# EAGLE schematic EEZ DIB DCP405 r2B11 (EAGLE 7.2.0)
Assembly variants: Farnell, TME

## Sheet 1 of 6: Power pre-regulator
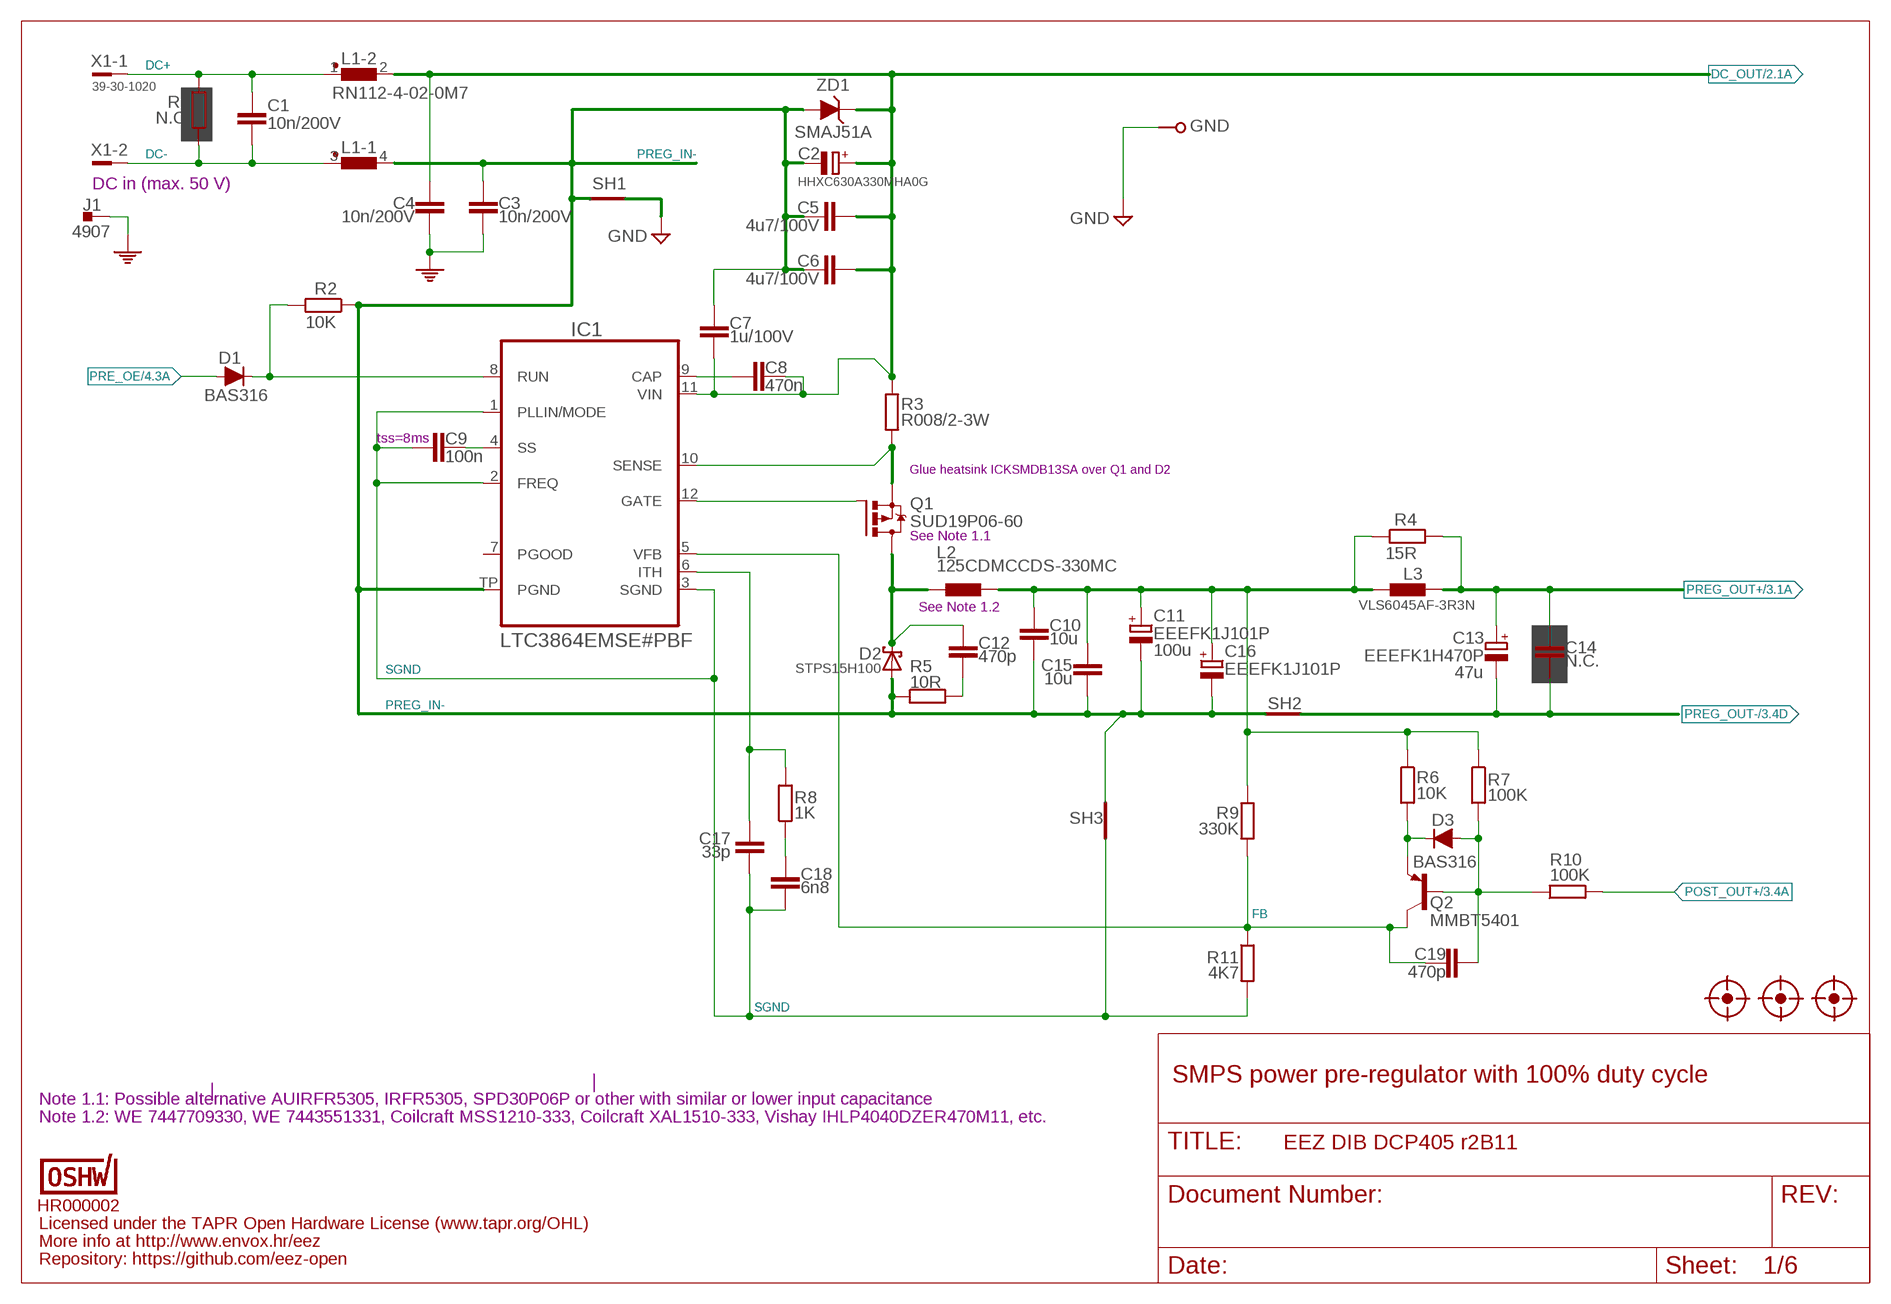
[diagram p0: schematic, sheet 1]

### Parts
C1  10n/200V  C-EUC1206  [C1206]
C2  HHXC630A330MHA0G  ECAPSMD8.3MM/HA0  [CAPAE830X1050N]
C3  10n/200V  C-EUC1206  [C1206]
C4  10n/200V  C-EUC1206  [C1206]
C5  4u7/100V  C-EUC1210  [C1210]
C6  4u7/100V  C-EUC1210  [C1210]
C7  1u/100V  C-EUC1206  [C1206]
C8  470n  C-EUC0805  [C0805]
C9  100n  C-EUC0603  [C0603]
C10  10u  C-EUC1210  [C1210]
C11  EEEFK1J101P  ECAP10X10  [CAPAE1030X1050N]
C12  470p  C-EUC0805  [C0805]
C13  EEEFK1H470P  ECAPSMD8.3MM/HA0  [CAPAE830X1050N]
C14  N.C.  C-EUC0805  [C0805]
C15  10u  C-EUC1210  [C1210]
C16  EEEFK1J101P  ECAP10X10  [CAPAE1030X1050N]
C17  33p  C-EUC0805  [C0805]
C18  6n8  C-EUC0805  [C0805]
C19  470p  C-EUC0805  [C0805]
D1  BAS316  DIODESOD323R  [SOD323-R]
D2  STPS15H100  SCHOTTKY-DUAL_A_L  [TO252-L]
D3  BAS316  DIODESOD323R  [SOD323-R]
FM1  FIDUCIAL_2  [FIDUCIAL_DUAL]
FM2  FIDUCIAL_2  [FIDUCIAL_DUAL]
FM3  FIDUCIAL_2  [FIDUCIAL_DUAL]
GND  PCB_TEST_TABSHIELD  [PCB_SHIELD_TAB]
IC1  LTC3864EMSE#PBF  LTC3864  [LTC_05-08-1666]
J1  4907  PCB_TAB-4907  [PCB_TAB-4907]
L1  RN112-4-02-0M7  RN112  [RN112]
L2  125CDMCCDS-330MC  125CDMCC/DS  [125CDMCC/DS]
L3  VLS6045AF-3R3N  COILCRAFT_HPI0630  [COILCRAFT_HPI0630]
OSHWA  HR000002  OSHWA-CERT-SMALL  [CERT-SMALL-SILK]
Q1  SUD19P06-60  P-MOSFETDPAK  [TO229P990X239-3N]
Q2  MMBT5401  BC857B-PNP-SOT23-BEC  [SOT23-BEC]
R1  N.C.  R-EU_R2512  [R2512]
R2  10K  R-EU_R0805  [R0805]
R3  R008/2-3W  R-EU_R2512  [R2512]
R4  15R  R-EU_R2010  [R2010]
R5  10R  R-EU_R1206  [R1206]
R6  10K  R-EU_R0805  [R0805]
R7  100K  R-EU_R0805  [R0805]
R8  1K  R-EU_R0805  [R0805]
R9  330K  R-EU_R0805  [R0805]
R10  100K  R-EU_R0805  [R0805]
R11  4K7  R-EU_R0805  [R0805]
SH1  SHORTNOHOLE  [SHORT_NOHOLE]
SH2  Pgnd to Pout- short  SHORTNOHOLE  [SHORT_NOHOLE]
SH3  Sgnd to Pgnd short  SHORTNOHOLE  [SHORT_NOHOLE]
X1  39-30-1020  MINIFIT_39301020  [MINIFIT_39301020]
ZD1  SMAJ51A  P6SMB68A  [DO214AA]

### Nets
DC+: C1.2 L1.1 R1.2 X1.1
DC-: C1.1 L1.3 R1.1 X1.2
DC_OUT: C2.+ C4.2 C5.1 C6.1 C7.1 C8.2 IC1.11(VIN) L1.2 R3.1 ZD1.C ; also sheet 2
FB: C19.1 IC1.5(VFB) Q2.C R9.2 R11.1
GND: GND.1 SH1.2(GND_B) ; also sheet 2,3,4,5,6
L_OUT: C10.1 C11.+ C15.1 C16.+ L2.2 L3.1 R4.1 R6.1 R7.1 R9.1
N$1: D3.C Q2.E R6.2
N$2: C18.1 R8.1
N$7: D1.C IC1.8(RUN) R2.2
N$8: C17.1 IC1.6(ITH) R8.2
N$23: C8.1 IC1.9(CAP)
N$27: C9.2 IC1.4(SS)
N$30: IC1.12(GATE) Q1.1(G)
N$38: C12.2 R5.2
N$79: C19.2 D3.A Q2.B R7.2 R10.1
PE: C3.2 C4.1 J1.1 J1.2 ; also sheet 6
POST_OUT+: R10.2 ; also sheet 3,6
PRE_OE: D1.A ; also sheet 4
PREG_IN-: C2.- C3.1 C5.2 C6.2 C7.2 C10.2 C11.- C15.2 C16.- D2.1(A) D2.2(A) IC1.TP(PGND) L1.4 R2.1 R5.1 SH1.1(GND_A) SH2.2(GND_B) SH3.2(GND_B) ZD1.A
PREG_OUT+: C13.+ C14.1 L3.2 R4.2 ; also sheet 3
PREG_OUT-: C13.- C14.2 SH2.1(GND_A) ; also sheet 3,5
SENSE: IC1.10(SENSE) Q1.3(S) R3.2
SGND: C9.1 C17.2 C18.2 IC1.1(PLLIN/MODE) IC1.2(FREQ) IC1.3(SGND) R11.2 SH3.1(GND_A)
SW: C12.1 D2.3(C) L2.1 Q1.2(D)
Unconnected: IC1.7(PGOOD)

### Notes on the sheet
- DC in (max. 50 V)
- tss=8ms
- Glue heatsink ICKSMDB13SA over Q1 and D2
- See Note 1.1
- See Note 1.2
- 100u
- 47u
- SMPS power pre-regulator with 100% duty cycle
- Note 1.1: Possible alternative AUIRFR5305, IRFR5305, SPD30P06P or other with similar or lower input capacitance
- Note 1.2: WE 7447709330, WE 7443551331, Coilcraft MSS1210-333, Coilcraft XAL1510-333, Vishay IHLP4040DZER470M11, etc.
- Licensed under the TAPR Open Hardware License (www.tapr.org/OHL)
- More info at http://www.envox.hr/eez
- Repository: https://github.com/eez-open

## Sheet 2 of 6: Bias power, DIB interface
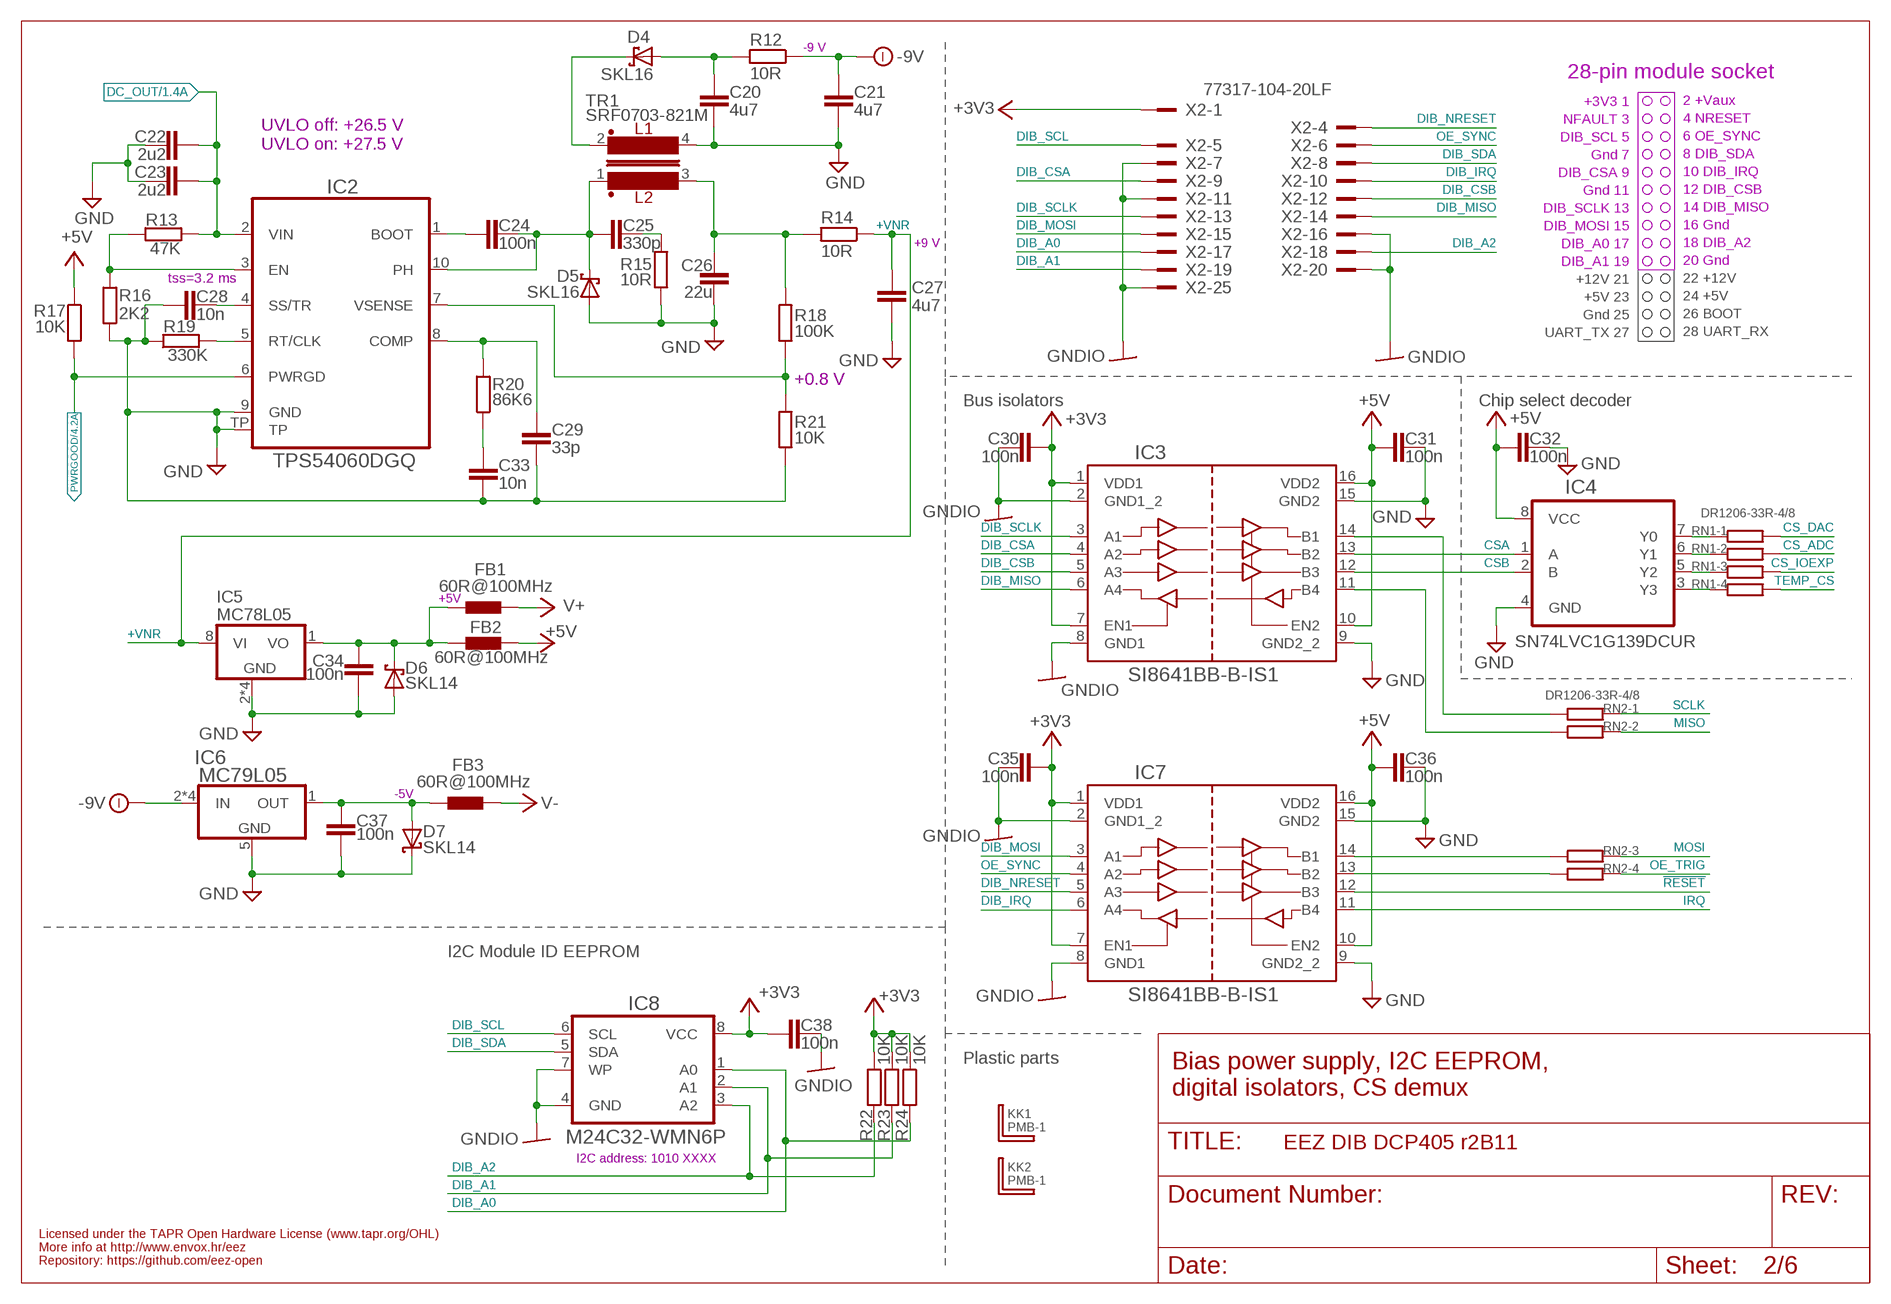
[diagram p1: schematic, sheet 2]

### Parts
C20  4u7  C-EUC1206  [C1206]
C21  4u7  C-EUC1206  [C1206]
C22  2u2  C-EUC1206  [C1206]
C23  2u2  C-EUC1206  [C1206]
C24  100n  C-EUC0603  [C0603]
C25  330p  C-EUC0805  [C0805]
C26  22u  C-EUC1210  [C1210]
C27  4u7  C-EUC1206  [C1206]
C28  10n  C-EUC0805  [C0805]
C29  33p  C-EUC0805  [C0805]
C30  100n  C-EUC0603  [C0603]
C31  100n  C-EUC0603  [C0603]
C32  100n  C-EUC0603  [C0603]
C33  10n  C-EUC0805  [C0805]
C34  100n  C-EUC0603  [C0603]
C35  100n  C-EUC0603  [C0603]
C36  100n  C-EUC0603  [C0603]
C37  100n  C-EUC0603  [C0603]
C38  100n  C-EUC0603  [C0603]
D4  SKL16  SCHOTTKYSOD123  [SOD123]
D5  SKL16  SCHOTTKYSOD123  [SOD123]
D6  SKL14  SCHOTTKYSOD123  [SOD123]
D7  SKL14  SCHOTTKYSOD123  [SOD123]
FB1  60R@100MHz  FERRITE_BEAD0603  [BEAD0603]
FB2  60R@100MHz  FERRITE_BEAD0603  [BEAD0603]
FB3  60R@100MHz  FERRITE_BEAD0603  [BEAD0603]
IC2  TPS54060DGQ  [SOP50P490X110-11N]
IC3  SI8641BB-B-IS1  SI8641NSOIC-16  [SOIC-16]
IC4  SN74LVC1G139DCUR  SN74LVC1G139-VSSOP  [DCU8]
IC5  MC78L05  MC78LXXSOIC8  [SOIC127P600X173-8N]
IC6  MC79L05  MC79LXXSOIC  [SOIC127P600X173-8N]
IC7  SI8641BB-B-IS1  SI8641NSOIC-16  [SOIC-16]
IC8  M24C32-WMN6P  AT24CXXSOIC8  [SOIC127P600X173-8N]
KK1  PMB-1  PCB-MB  [PCB-MB]
KK2  PMB-1  PCB-MB  [PCB-MB]
R12  10R  R-EU_R1206  [R1206]
R13  47K  R-EU_R0805  [R0805]
R14  10R  R-EU_R1206  [R1206]
R15  10R  R-EU_R1206  [R1206]
R16  2K2  R-EU_R0805  [R0805]
R17  10K  R-EU_R0805  [R0805]
R18  100K  R-EU_R0805  [R0805]
R19  330K  R-EU_R0805  [R0805]
R20  86K6  R-EU_R0805  [R0805]
R21  10K  R-EU_R0805  [R0805]
R22  10K  R-EU_R0805  [R0805]
R23  10K  R-EU_R0805  [R0805]
R24  10K  R-EU_R0805  [R0805]
RN1  DR1206-33R-4/8  R_ARRAY4  [CAY16]
RN2  DR1206-33R-4/8  R_ARRAY4  [CAY16]
TR1  SRF0703-821M  BOURNS_SRF0703INV  [SRF0703]
X2  77317-104-20LF  77317-104-28LF  [77317-104-28LF]

### Nets
!RESET: IC7.12(B3) ; also sheet 4
+3V3: C30.1 C35.1 C38.2 IC3.1(VDD1) IC3.7(EN1) IC7.1(VDD1) IC7.7(EN1) IC8.8(VCC) R22.1 R23.1 R24.1 X2.1
+5V: C31.2 C32.1 C36.2 FB2.P$2 IC3.10(EN2) IC3.16(VDD2) IC4.8(VCC) IC7.10(EN2) IC7.16(VDD2) R17.1 ; also sheet 4,5,6
+5VOUT: C34.1 D6.C FB1.P$1 FB2.P$1 IC5.1(VO)
+VNR: C27.1 IC5.8(VI) R14.1
-9V: C21.1 IC6.2(IN) IC6.3(IN) IC6.6(IN) IC6.7(IN) R12.1 ; also sheet 3
CS_ADC: RN1.7 ; also sheet 4
CS_DAC: RN1.8 ; also sheet 4
CS_IOEXP: RN1.6 ; also sheet 4
CSA: IC3.13(B2) IC4.1(A)
CSB: IC3.12(B3) IC4.2(B)
DC_OUT: C22.1 C23.1 IC2.2(VIN) R13.2 ; also sheet 1
DIB_A0: IC8.1(A0) R24.2 X2.17
DIB_A1: IC8.2(A1) R23.2 X2.19
DIB_A2: IC8.3(A2) R22.2 X2.18
DIB_CSA: IC3.4(A2) X2.9
DIB_CSB: IC3.5(A3) X2.12
DIB_IRQ: IC7.6(A4) X2.10
DIB_MISO: IC3.6(A4) X2.14
DIB_MOSI: IC7.3(A1) X2.15
DIB_NRESET: IC7.5(A3) X2.4
DIB_SCL: IC8.6(SCL) X2.5
DIB_SCLK: IC3.3(A1) X2.13
DIB_SDA: IC8.5(SDA) X2.8
GND: C20.2 C21.2 C22.2 C23.2 C26.2 C27.2 C28.2 C29.1 C31.1 C32.2 C33.1 C34.2 C36.1 C37.1 D5.A D6.A D7.C IC2.9(GND) IC2.TP IC3.9(GND2_2) IC3.15(GND2) IC4.4(GND) IC5.2(GND) IC5.3(GND) IC5.6(GND) IC5.7(GND) IC6.5(GND) IC7.9(GND2_2) IC7.15(GND2) R15.1 R16.1 R19.1 R21.1 TR1.4 ; also sheet 1,3,4,5,6
GNDIO: C30.2 C35.2 C38.1 IC3.2(GND1_2) IC3.8(GND1) IC7.2(GND1_2) IC7.8(GND1) IC8.4(GND) IC8.7(WP) X2.7 X2.11 X2.16 X2.20 X2.25
IRQ: IC7.11(B4) ; also sheet 4
MISO: RN2.7 ; also sheet 4
MOSI: RN2.6 ; also sheet 4
N$3: IC7.13(B2) RN2.4
N$4: IC4.5(Y2) RN1.3
N$6: IC4.7(Y0) RN1.1
N$9: IC3.11(B4) RN2.2
N$22: IC4.6(Y1) RN1.2
N$26: C25.2 R15.2
N$29: C37.2 D7.A FB3.P$1 IC6.1(OUT)
N$34: IC2.3(EN) R13.1 R16.2
N$41: C28.1 IC2.4(SS/TR)
N$48: IC2.5(RT/CLK) R19.2
N$50: C29.2 IC2.8(COMP) R20.2
N$51: C33.2 R20.1
N$52: IC4.3(Y3) RN1.4
N$60: C24.2 IC2.1(BOOT)
N$61: IC7.14(B1) RN2.3
N$62: IC2.7(VSENSE) R18.1 R21.2
N$122: IC3.14(B1) RN2.1
N$179: C20.1 D4.A R12.2
OE_SYNC: IC7.4(A2) X2.6
OE_TRIG: RN2.5 ; also sheet 4
PH: C24.1 C25.1 D5.C IC2.10(PH) TR1.1
PWRGOOD: IC2.6(PWRGD) R17.2 ; also sheet 4
SCLK: RN2.8 ; also sheet 4
TEMP_CS: RN1.5 ; also sheet 4
V+: FB1.P$2 ; also sheet 3,4,5
V-: FB3.P$2 ; also sheet 3,5
VOUT+: C26.1 R14.2 R18.2 TR1.3
VOUT-: D4.C TR1.2
Unconnected: X2.2 X2.3 X2.21 X2.22 X2.23 X2.24 X2.26 X2.27 X2.28

### Notes on the sheet
- -9 V
- 28-pin module socket
- +3V3 1
- 2 +Vaux
- NFAULT 3
- 4 NRESET
- DIB_SCL 5
- 6 OE_SYNC
- UVLO off: +26.5 V
  UVLO on: +27.5 V
- Gnd 7
- 8 DIB_SDA
- DIB_CSA 9
- 10 DIB_IRQ
- Gnd 11
- 12 DIB_CSB
- DIB_SCLK 13
- 14 DIB_MISO
- DIB_MOSI 15
- 16 Gnd
- +9 V | DIB_A0 17
- 18 DIB_A2
- DIB_A1 19
- 20 Gnd
- +12V 21
- tss=3.2 ms | 22 +12V
- +5V 23
- 24 +5V
- Gnd 25
- 26 BOOT
- UART_TX 27
- 28 UART_RX
- +0.8 V
- Bus isolators | Chip select decoder
- +5V
- -5V
- I2C Module ID EEPROM
- Plastic parts
- Bias power supply, I2C EEPROM,
  digital isolators, CS demux
- I2C address: 1010 XXXX
- Licensed under the TAPR Open Hardware License (www.tapr.org/OHL)
- More info at http://www.envox.hr/eez
- Repository: https://github.com/eez-open

## Sheet 3 of 6: Post-regulator
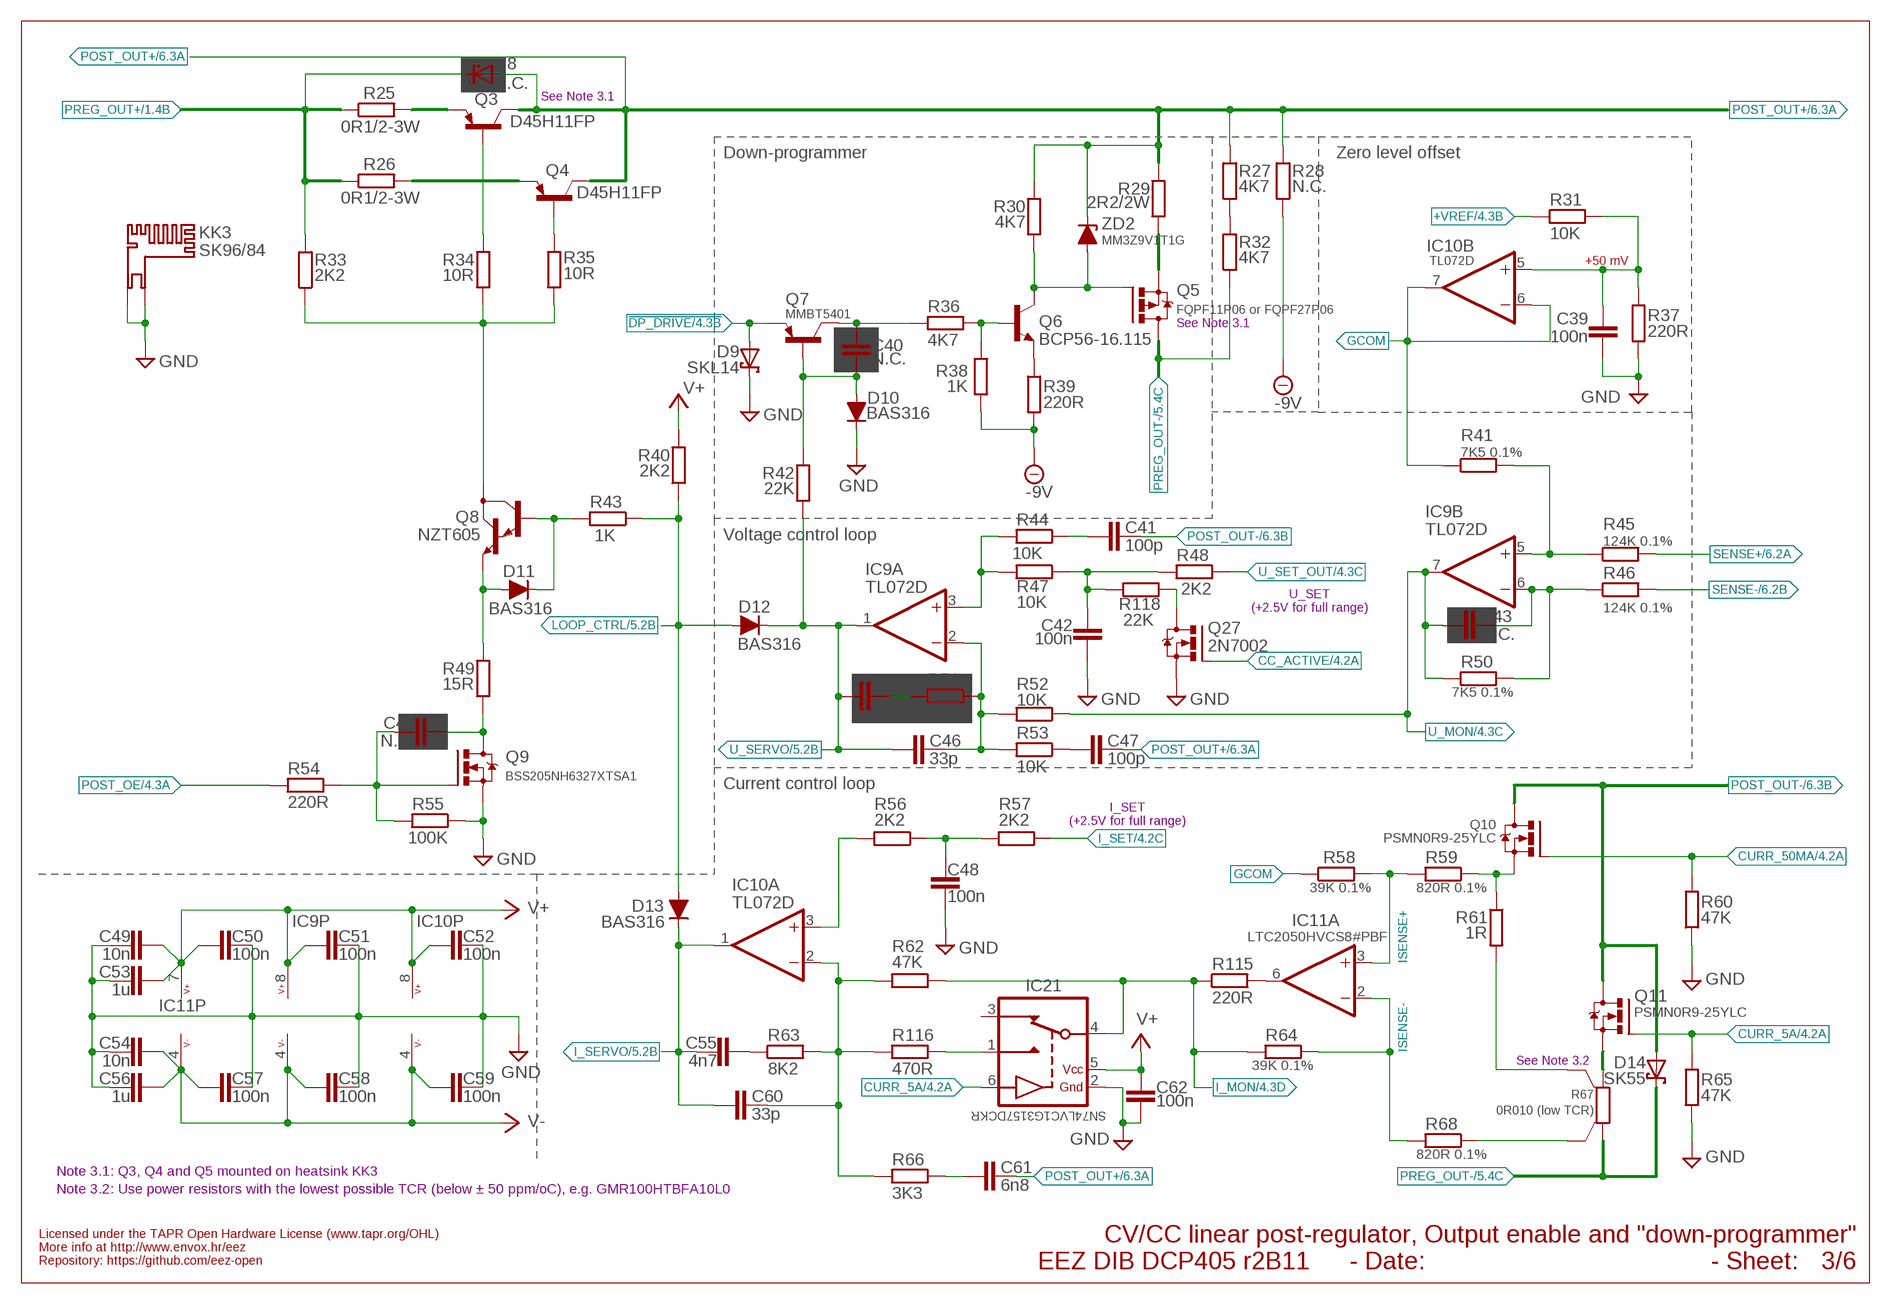
[diagram p2: schematic, sheet 3]

### Parts
C39  100n  C-EUC0603  [C0603]
C40  N.C.  C-EUC0805  [C0805]
C41  100p  C-EUC0805  [C0805]
C42  100n  C-EUC0603  [C0603]
C43  N.C.  C-EUC0805  [C0805]
C44  N.C.  C-EUC0805  [C0805]
C45  N.C.  C-EUC0805  [C0805]
C46  33p  C-EUC0805  [C0805]
C47  100p  C-EUC0805  [C0805]
C48  100n  C-EUC0603  [C0603]
C49  10n  C-EUC0805  [C0805]
C50  100n  C-EUC0603  [C0603]
C51  100n  C-EUC0603  [C0603]
C52  100n  C-EUC0603  [C0603]
C53  1u  C-EUC0805  [C0805]
C54  10n  C-EUC0805  [C0805]
C55  4n7  C-EUC0805  [C0805]
C56  1u  C-EUC0805  [C0805]
C57  100n  C-EUC0603  [C0603]
C58  100n  C-EUC0603  [C0603]
C59  100n  C-EUC0603  [C0603]
C60  33p  C-EUC0805  [C0805]
C61  6n8  C-EUC0805  [C0805]
C62  100n  C-EUC0603  [C0603]
D8  N.C.  SCHOTTKYSOD123  [SOD123]
D9  SKL14  SCHOTTKYSOD123  [SOD123]
D10  BAS316  DIODESOD323R  [SOD323-R]
D11  BAS316  DIODESOD323R  [SOD323-R]
D12  BAS316  DIODESOD323R  [SOD323-R]
D13  BAS316  DIODESOD323R  [SOD323-R]
D14  SK55  SCHOTTKYSMB  [SMB]
IC9  TL072D  TL072SOIC8  [SOIC127P600X173-8N]
IC10  TL072D  TL072SOIC8  [SOIC127P600X173-8N]
IC11  LTC2050HVCS8#PBF  OP27GSZSO8  [SOIC127P600X173-8N]
IC21  SN74LVC1G3157DCKR  SN74LVC1G3157-DCK  [SOT65P210X110-6N]
KK3  SK96/84  [SK96/84]
Q3  D45H11FP  D45H11-FPV  [TO220FP-V]
Q4  D45H11FP  D45H11-FPV  [TO220FP-V]
Q5  FQPF11P06 or FQPF27P06  P-MOSFET-FPV  [TO220FP-V]
Q6  BCP56-16.115  BCP56  [SOT230P700X180-4N]
Q7  MMBT5401  BC857B-PNP-SOT23-BEC  [SOT23-BEC]
Q8  NZT605  [SOT230P700X180-4N]
Q9  BSS205NH6327XTSA1  2N7002  [SOT103P240X110-3N]
Q10  PSMN0R9-25YLC  N-MOSFETLFPAK  [SOT669]
Q11  PSMN0R9-25YLC  N-MOSFETLFPAK  [SOT669]
Q27  2N7002  [SOT103P240X110-3N]
R25  0R1/2-3W  R-EU_R2512  [R2512]
R26  0R1/2-3W  R-EU_R2512  [R2512]
R27  4K7  R-EU_R0805  [R0805]
R28  N.C.  R-EU_R0805  [R0805]
R29  2R2/2W  R-EU_R2512  [R2512]
R30  4K7  R-EU_R0805  [R0805]
R31  10K  R-EU_R0805  [R0805]
R32  4K7  R-EU_R0805  [R0805]
R33  2K2  R-EU_R0805  [R0805]
R34  10R  R-EU_R1206  [R1206]
R35  10R  R-EU_R1206  [R1206]
R36  4K7  R-EU_R0805  [R0805]
R37  220R  R-EU_R0805  [R0805]
R38  1K  R-EU_R0805  [R0805]
R39  220R  R-EU_R0805  [R0805]
R40  2K2  R-EU_R0805  [R0805]
R41  7K5 0.1%  R-EU_R0805  [R0805]
R42  22K  R-EU_R0805  [R0805]
R43  1K  R-EU_R0805  [R0805]
R44  10K  R-EU_R0805  [R0805]
R45  124K 0.1%  R-EU_R0805  [R0805]
R46  124K 0.1%  R-EU_R0805  [R0805]
R47  10K  R-EU_R0805  [R0805]
R48  2K2  R-EU_R0805  [R0805]
R49  15R  R-EU_R2010  [R2010]
R50  7K5 0.1%  R-EU_R0805  [R0805]
R51  N.C.  R-EU_R0805  [R0805]
R52  10K  R-EU_R0805  [R0805]
R53  10K  R-EU_R0805  [R0805]
R54  220R  R-EU_R0805  [R0805]
R55  100K  R-EU_R0805  [R0805]
R56  2K2  R-EU_R0805  [R0805]
R57  2K2  R-EU_R0805  [R0805]
R58  39K 0.1%  R-EU_R0805  [R0805]
R59  820R 0.1%  R-EU_R0805  [R0805]
R60  47K  R-EU_R0805  [R0805]
R61  1R  R-EU_R1206  [R1206]
R62  47K  R-EU_R0805  [R0805]
R63  8K2  R-EU_R0805  [R0805]
R64  39K 0.1%  R-EU_R0805  [R0805]
R65  47K  R-EU_R0805  [R0805]
R66  3K3  R-EU_R0805  [R0805]
R67  0R010 (low TCR)  R-EU_4WIRE2512  [R_2512-4WIRE]
R68  820R 0.1%  R-EU_R0805  [R0805]
R115  220R  R-EU_R0805  [R0805]
R116  470R  R-EU_R0805  [R0805]
R118  22K  R-EU_R0805  [R0805]
ZD2  MM3Z9V1T1G  ZENER-DIODESOD323R  [SOD323-R]

### Nets
5A_S: Q11.1(S) Q11.2(S) Q11.3(S) R67.2
50MA_S: Q10.1(S) Q10.2(S) Q10.3(S) R59.1 R61.1
!DP_DRIVE: D9.A Q7.E ; also sheet 4
+VREF: R31.1 ; also sheet 4
-9V: R28.1 R38.2 R39.2 ; also sheet 2
CC_ACTIVE: Q27.1(G) ; also sheet 4,5
CURR_5A: IC21.6(CTRL) Q11.4(G) R65.2 ; also sheet 4
CURR_50MA: Q10.4(G) R60.2 ; also sheet 4
DARL_C: Q8.2(C) Q8.4(C) R33.1 R34.1 R35.1
DP_S: Q5.3(S) R29.1
GCOM: IC10.6(B:-IN) IC10.7(B:OUT) R41.1 R58.1
GND: C39.2 C42.2 C48.2 C49.1 C50.2 C51.1 C52.1 C53.1 C54.1 C56.1 C57.2 C58.1 C59.1 C62.2 D9.C D10.C IC21.2(GND) KK3.1 KK3.2 Q9.2(S) Q27.2(S) R37.2 R55.1 R60.1 R65.1 ; also sheet 1,2,4,5,6
I_MON: IC21.4(COM) R62.1 R64.2 R115.1 ; also sheet 4
I_SERVO: C55.2 C60.2 D13.C IC10.1(A:OUT) ; also sheet 5
I_SET: R57.1 ; also sheet 4
ISENSE+: IC11.3(A:+IN) R58.2 R59.2
ISENSE-: IC11.2(A:-IN) R64.1 R68.2
LOOP_CTRL: D12.A D13.A R40.1 R43.1 ; also sheet 5
N$10: C48.1 R56.1 R57.2
N$11: R61.2 R67.2S
N$14: C44.1 R51.2
N$35: C45.2 Q9.3(D) R49.1
N$37: C55.1 R63.1
N$39: Q6.1(B) R36.1 R38.1
N$40: Q4.1(B) R35.2
N$43: Q3.1(B) R34.2
N$45: C40.2 Q7.C R36.2
N$46: D11.C Q8.1(B) R43.2
N$47: D11.A Q8.3(E) R49.2
N$49: R27.1 R32.2
N$53: C45.1 Q9.1(G) R54.1 R55.2
N$54: IC11.6(A:OUT) R115.2
N$55: C40.1 D10.A Q7.B R42.2
N$57: IC21.1(NO) R116.1
N$58: Q27.3(D) R118.1
N$82: IC10.3(A:+IN) R56.2
N$83: IC9.3(A:+IN) R44.2 R47.2
N$84: C46.1 IC9.2(A:-IN) R51.1 R52.2 R53.2
N$88: C61.2 R66.1
N$89: C60.1 IC10.2(A:-IN) R62.2 R63.2 R66.2 R116.2
N$90: C41.2 R44.1
N$91: C47.2 R53.1
N$98: Q6.3(E) R39.1
N$102: C39.1 IC10.5(B:+IN) R31.2 R37.1
N$150: IC9.5(B:+IN) R41.2 R45.1
N$158: C43.1 IC9.6(B:-IN) R46.1 R50.2
N$200: R67.1S R68.1
PASS_E1: Q3.3(E) R25.2
PASS_E2: Q4.3(E) R26.2
POST_OE: R54.2 ; also sheet 4
POST_OUT+: C47.1 C61.1 D8.A Q3.2(C) Q4.2(C) R27.2 R28.2 R29.2 R30.1 ZD2.C ; also sheet 1,6
POST_OUT-: C41.1 D14.A Q10.MB(D) Q11.MB(D) ; also sheet 6
PREG_OUT+: D8.C R25.1 R26.1 R33.2 ; also sheet 1
PREG_OUT-: D14.C Q5.2(D) R32.1 R67.1 ; also sheet 1,5
Q6C: Q5.1(G) Q6.2(C) Q6.4(C) R30.2 ZD2.A
SENSE+: R45.2 ; also sheet 6
SENSE-: R46.2 ; also sheet 6
U_MON: C43.2 IC9.7(B:OUT) R50.1 R52.1 ; also sheet 4,5
U_SERVO: C44.2 C46.2 D12.C IC9.1(A:OUT) R42.1 ; also sheet 5
U_SET_OUT: R48.1 ; also sheet 4,5
U_SET_OVP: C42.1 R47.1 R48.2 R118.2
V+: C49.2 C50.1 C51.2 C52.2 C53.2 C62.1 IC9.8(P:V+) IC10.8(P:V+) IC11.7(P:V+) IC21.5(VDD) R40.2 ; also sheet 2,4,5
V-: C54.2 C56.2 C57.1 C58.2 C59.2 IC9.4(P:V-) IC10.4(P:V-) IC11.4(P:V-) ; also sheet 2,5
Unconnected: IC21.3(NC)

### Notes on the sheet
- See Note 3.1
- Down-programmer | Zero level offset
- +50 mV
- See Note 3.1
- Voltage control loop
- U_SET
  (+2.5V for full range)
- Current control loop
- I_SET
  (+2.5V for full range)
- See Note 3.2
- Note 3.1: Q3, Q4 and Q5 mounted on heatsink KK3
- Note 3.2: Use power resistors with the lowest possible TCR (below ± 50 ppm/oC), e.g. GMR100HTBFA10L0
- Licensed under the TAPR Open Hardware License (www.tapr.org/OHL)
- CV/CC linear post-regulator, Output enable and "down-programmer"
- More info at http://www.envox.hr/eez
- Repository: https://github.com/eez-open
- - Date: | - Sheet:

## Sheet 4 of 6: Digital control, Vref
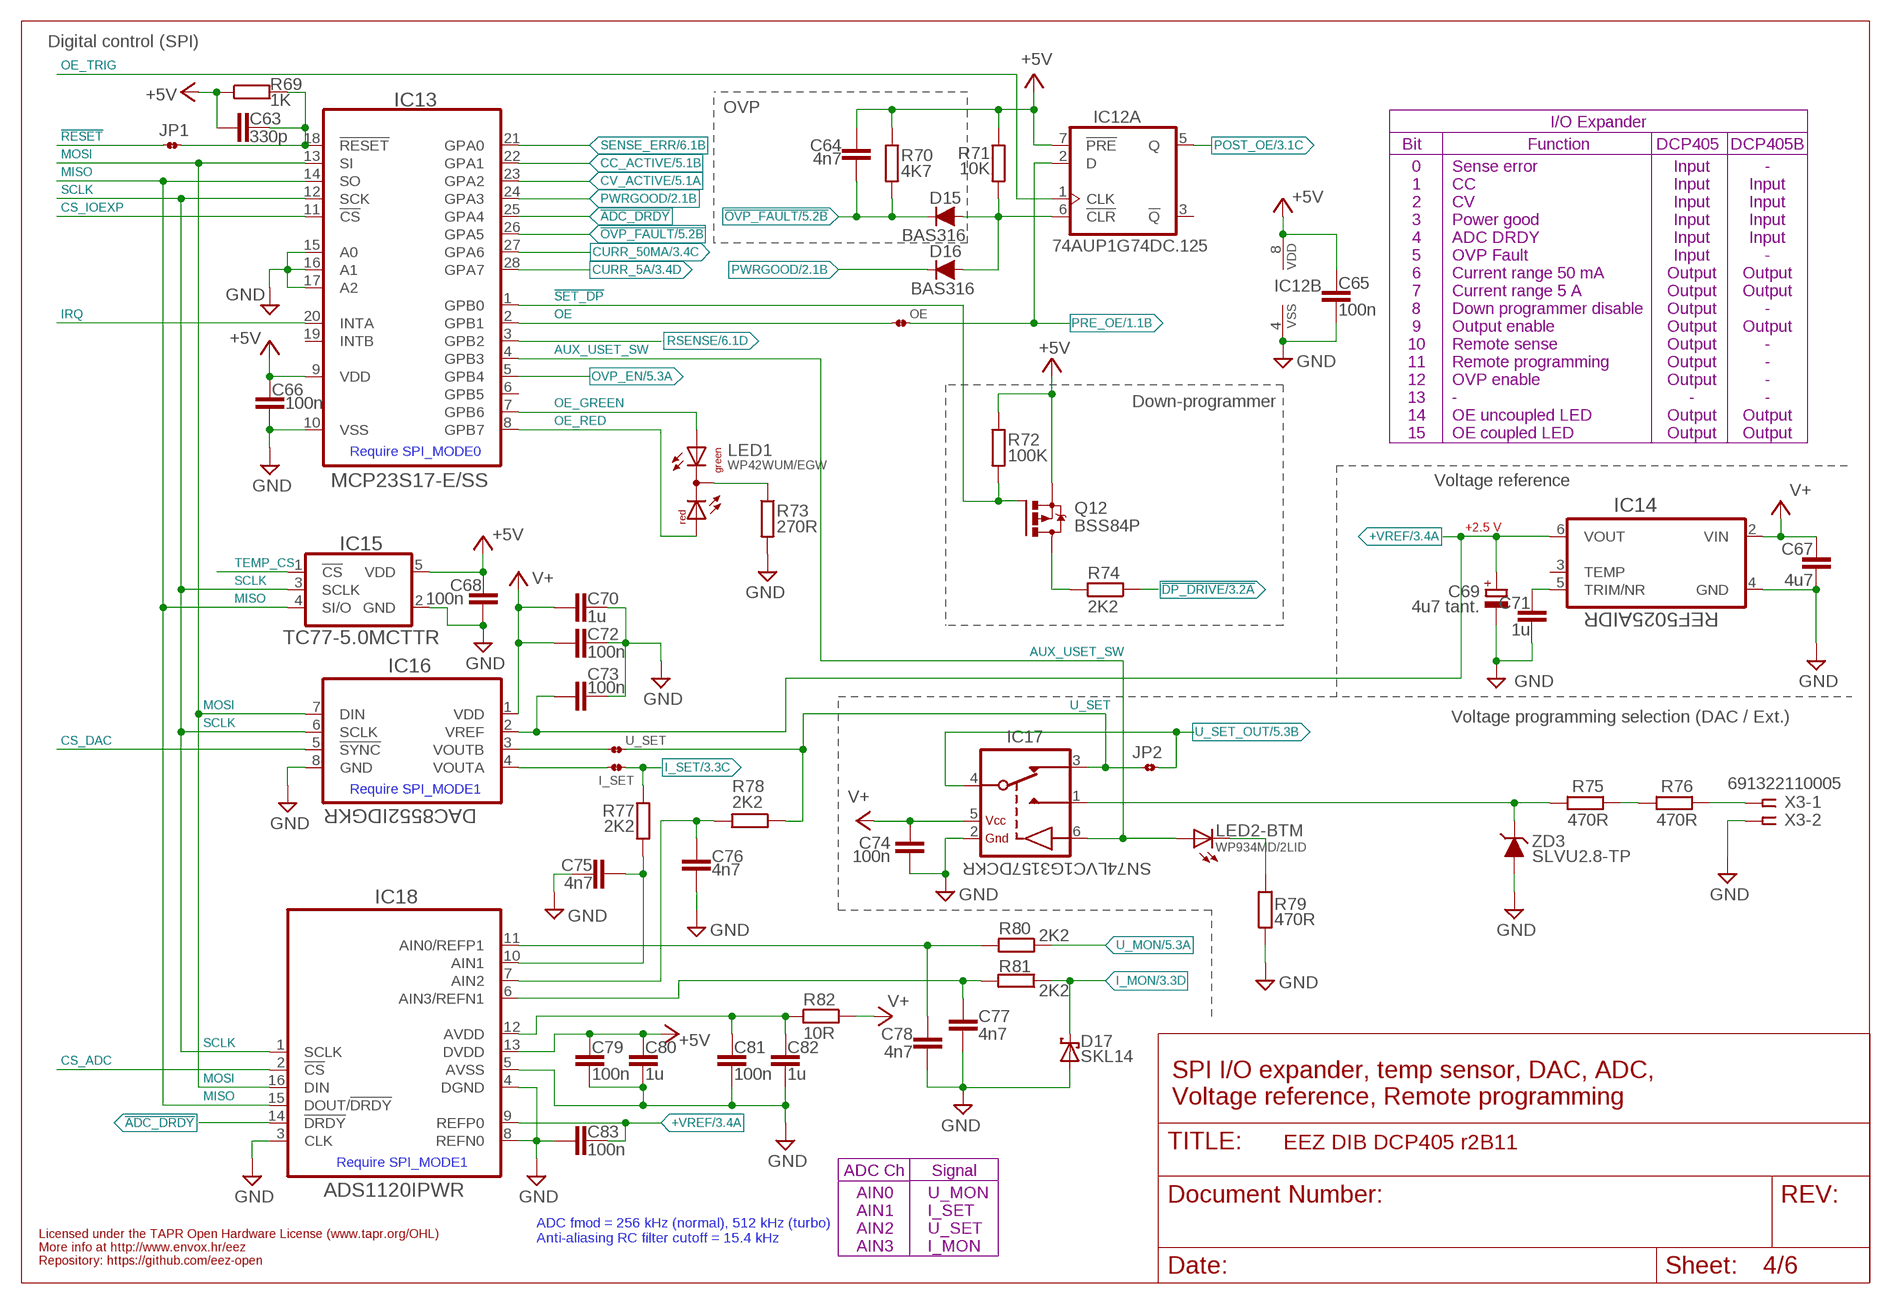
[diagram p3: schematic, sheet 4]

### Parts
C63  330p  C-EUC0805  [C0805]
C64  4n7  C-EUC0805  [C0805]
C65  100n  C-EUC0603  [C0603]
C66  100n  C-EUC0603  [C0603]
C67  4u7  C-EUC1206  [C1206]
C68  100n  C-EUC0603  [C0603]
C69  4u7 tant.  ECAP1206  [EC1206]
C70  1u  C-EUC0805  [C0805]
C71  1u  C-EUC0805  [C0805]
C72  100n  C-EUC0603  [C0603]
C73  100n  C-EUC0603  [C0603]
C74  100n  C-EUC0603  [C0603]
C75  4n7  C-EUC0805  [C0805]
C76  4n7  C-EUC0805  [C0805]
C77  4n7  C-EUC0805  [C0805]
C78  4n7  C-EUC0805  [C0805]
C79  100n  C-EUC0603  [C0603]
C80  1u  C-EUC0805  [C0805]
C81  100n  C-EUC0603  [C0603]
C82  1u  C-EUC0805  [C0805]
C83  100n  C-EUC0603  [C0603]
D15  BAS316  DIODESOD323R  [SOD323-R]
D16  BAS316  DIODESOD323R  [SOD323-R]
D17  SKL14  SCHOTTKYSOD123  [SOD123]
I_SET  JP2-NOCUT  [JP2-NOCUT]
IC12  74AUP1G74DC.125  SN74LVC1G74DCTR-VSSOP  [DCU8]
IC13  MCP23S17-E/SS  MCP23S17-E/SSSSOP  [SOP65P780X200-28N]
IC14  REF5025AIDR  REF50XX  [SOIC127P600X175-8N]
IC15  TC77-5.0MCTTR  TC77  [SOT23-5]
IC16  DAC8552IDGKR  DAC8552_DGK_8M  [DGK8-M]
IC17  SN74LVC1G3157DCKR  SN74LVC1G3157-DCK  [SOT65P210X110-6N]
IC18  ADS1120IPWR  ADS1120TSSOP-16  [PW(R-PDSO-G16)]
JP1  JP2-NOCUT  [JP2-NOCUT]
JP2  JP2-CUT-0805  [R_0805]
LED1  WP42WUM/EGW  LED_L-42WUM/1EGWT  [L-42WUM-1EGWT]
LED2  WP934MD/2LID  [WP934MD]
OE  JP2-NOCUT  [JP2-NOCUT]
Q12  BSS84P  IRLML2246TRPBF  [SOT95P237X112-3N]
R69  1K  R-EU_R0805  [R0805]
R70  4K7  R-EU_R0805  [R0805]
R71  10K  R-EU_R0805  [R0805]
R72  100K  R-EU_R0805  [R0805]
R73  270R  R-EU_R0805  [R0805]
R74  2K2  R-EU_R0805  [R0805]
R75  470R  R-EU_R0805  [R0805]
R76  470R  R-EU_R0805  [R0805]
R77  2K2  R-EU_R0805  [R0805]
R78  2K2  R-EU_R0805  [R0805]
R79  470R  R-EU_R0805  [R0805]
R80  2K2  R-EU_R0805  [R0805]
R81  2K2  R-EU_R0805  [R0805]
R82  10R  R-EU_R1206  [R1206]
U_SET  JP2-NOCUT  [JP2-NOCUT]
X3  691322110005  MC1,5/5-G-3,5  [MC1,5/5-G-3,5]
ZD3  SLVU2.8-TP  SLVU2.8  [SOT23]

### Nets
!ADC_DRDY: IC13.25(GPA4) IC18.14(!DRDY)
!DP_DRIVE: R74.1 ; also sheet 3
!IOEXP_RST: C63.1 IC13.18(!RESET) JP1.2 R69.2
!OVP_FAULT: C64.1 D15.C IC13.26(GPA5) R70.2 ; also sheet 5
!RESET: JP1.1 ; also sheet 2
!SET_DP: IC13.1(GPB0) Q12.1(G) R72.2
+5V: C63.2 C64.2 C65.2 C66.1 C68.1 C79.2 C80.2 IC12.7(A:!PRE) IC12.8(B:VDD) IC13.9(VDD) IC15.5(VDD) IC18.13(DVDD) Q12.2(S) R69.1 R70.1 R71.1 R72.1 ; also sheet 2,5,6
+VREF: C69.+ C73.2 C83.2 IC14.6(VOUT) IC16.2(VREF) IC18.9(REFP0) ; also sheet 3
AUX_IN: IC17.1(NO) R75.1 ZD3.3(C)
AUX_USET_SW: IC13.4(GPB3) IC17.6(CTRL) LED2.BA(-BTM:A)
CC_ACTIVE: IC13.22(GPA1) ; also sheet 3,5
CS_ADC: IC18.2(!CS) ; also sheet 2
CS_DAC: IC16.5(!SYNC) ; also sheet 2
CS_IOEXP: IC13.11(!CS) ; also sheet 2
CURR_5A: IC13.28(GPA7) ; also sheet 3
CURR_50MA: IC13.27(GPA6) ; also sheet 3
CV_ACTIVE: IC13.23(GPA2) ; also sheet 5
GND: C65.1 C66.2 C67.2 C68.2 C69.- C70.2 C71.2 C72.1 C73.1 C74.2 C75.1 C76.1 C77.2 C78.1 C79.1 C80.1 C81.1 C82.1 C83.1 D17.A IC12.4(B:VSS) IC13.10(VSS) IC13.15(A0) IC13.16(A1) IC13.17(A2) IC14.4(GND) IC15.2(GND) IC16.8(GND) IC17.2(GND) IC18.3(CLK) IC18.4(DGND) IC18.5(AVSS) IC18.8(REFN0) R73.2 R79.1 X3.2 ZD3.1(A) ZD3.2(A) ; also sheet 1,2,3,5,6
I_MON: D17.C R81.1 ; also sheet 3
I_SET: I_SET.2 R77.1 ; also sheet 3
IRQ: IC13.20(INTA) ; also sheet 2
MISO: IC13.14(SO) IC15.4(SI/O) IC18.15(DOUT/!DRDY) ; also sheet 2
MOSI: IC13.13(SI) IC16.7(DIN) IC18.16(DIN) ; also sheet 2
N$12: LED1.CC(C) R73.1
N$16: I_SET.1 IC16.4(VOUTA)
N$17: R75.2 R76.1
N$32: R76.2 X3.1
N$36: IC16.3(VOUTB) U_SET.1
N$42: Q12.3(D) R74.2
N$56: D15.A D16.A IC12.6(A:!CLR) R71.2
N$70: C81.2 C82.2 IC18.12(AVDD) R82.2
N$71: C71.1 IC14.5(TRIM/NR)
N$72: C75.2 IC18.10(AIN1) R77.2
N$73: C78.2 IC18.11(AIN0/REFP1) R80.2
N$80: C76.2 IC18.7(AIN2) R78.2
N$81: C77.1 IC18.6(AIN3/REFN1) R81.2
N$121: LED2.BC(-BTM:C) R79.2
OE: IC13.2(GPB1) OE.1
OE_GREEN: IC13.7(GPB6) LED1.GREEN(AG)
OE_RED: IC13.8(GPB7) LED1.RED(AR)
OE_TRIG: IC12.1(A:CLK) ; also sheet 2
OVP_EN: IC13.5(GPB4) ; also sheet 5
POST_OE: IC12.5(A:Q) ; also sheet 3
PRE_OE: IC12.2(A:D) OE.2 ; also sheet 1
PWRGOOD: D16.C IC13.24(GPA3) ; also sheet 2
RSENSE: IC13.3(GPB2) ; also sheet 6
SCLK: IC13.12(SCK) IC15.3(SCLK) IC16.6(SCLK) IC18.1(SCLK) ; also sheet 2
SENSE_ERR: IC13.21(GPA0) ; also sheet 6
TEMP_CS: IC15.1(!CS) ; also sheet 2
U_MON: R80.1 ; also sheet 3,5
U_SET: IC17.3(NC) JP2.1 R78.1 U_SET.2
U_SET_OUT: IC17.4(COM) JP2.2 ; also sheet 3,5
V+: C67.1 C70.1 C72.2 C74.1 IC14.2(VIN) IC16.1(VDD) IC17.5(VDD) R82.1 ; also sheet 2,3,5
Unconnected: IC12.3(A:!Q) IC13.6(GPB5) IC13.19(INTB) IC14.3(TEMP)

### Notes on the sheet
- Digital control (SPI)
- OVP
- I/O Expander
- Bit | Function | DCP405 | DCP405B
- 0 | Sense error | Input | -
- 1 | CC | Input | Input
- 2 | CV | Input | Input
- 3 | Power good | Input | Input
- 4 | ADC DRDY | Input | Input
- 5 | OVP Fault | Input | -
- 6 | Current range 50 mA | Output | Output
- 7 | Current range 5 A | Output | Output
- 8 | Down programmer disable | Output | -
- 9 | Output enable | Output | Output
- 10 | Remote sense | Output | -
- 11 | Remote programming | Output | -
- 12 | OVP enable | Output | -
- Down-programmer | 13 | - | - | -
- 14 | OE uncoupled LED | Output | Output
- 15 | OE coupled LED | Output | Output
- Require SPI_MODE0
- Voltage reference
- +2.5 V
- Voltage programming selection (DAC / Ext.)
- Require SPI_MODE1
- SPI I/O expander, temp sensor, DAC, ADC, 
  Voltage reference, Remote programming
- Require SPI_MODE1
- ADC Ch | Signal
- AIN0 | U_MON
- AIN1 | I_SET
- AIN2 | U_SET
- Licensed under the TAPR Open Hardware License (www.tapr.org/OHL)
- ADC fmod = 256 kHz (normal), 512 kHz (turbo)
  Anti-aliasing RC filter cutoff = 15.4 kHz
- More info at http://www.envox.hr/eez | AIN3 | I_MON
- Repository: https://github.com/eez-open

## Sheet 5 of 6: CC/CV, OVP
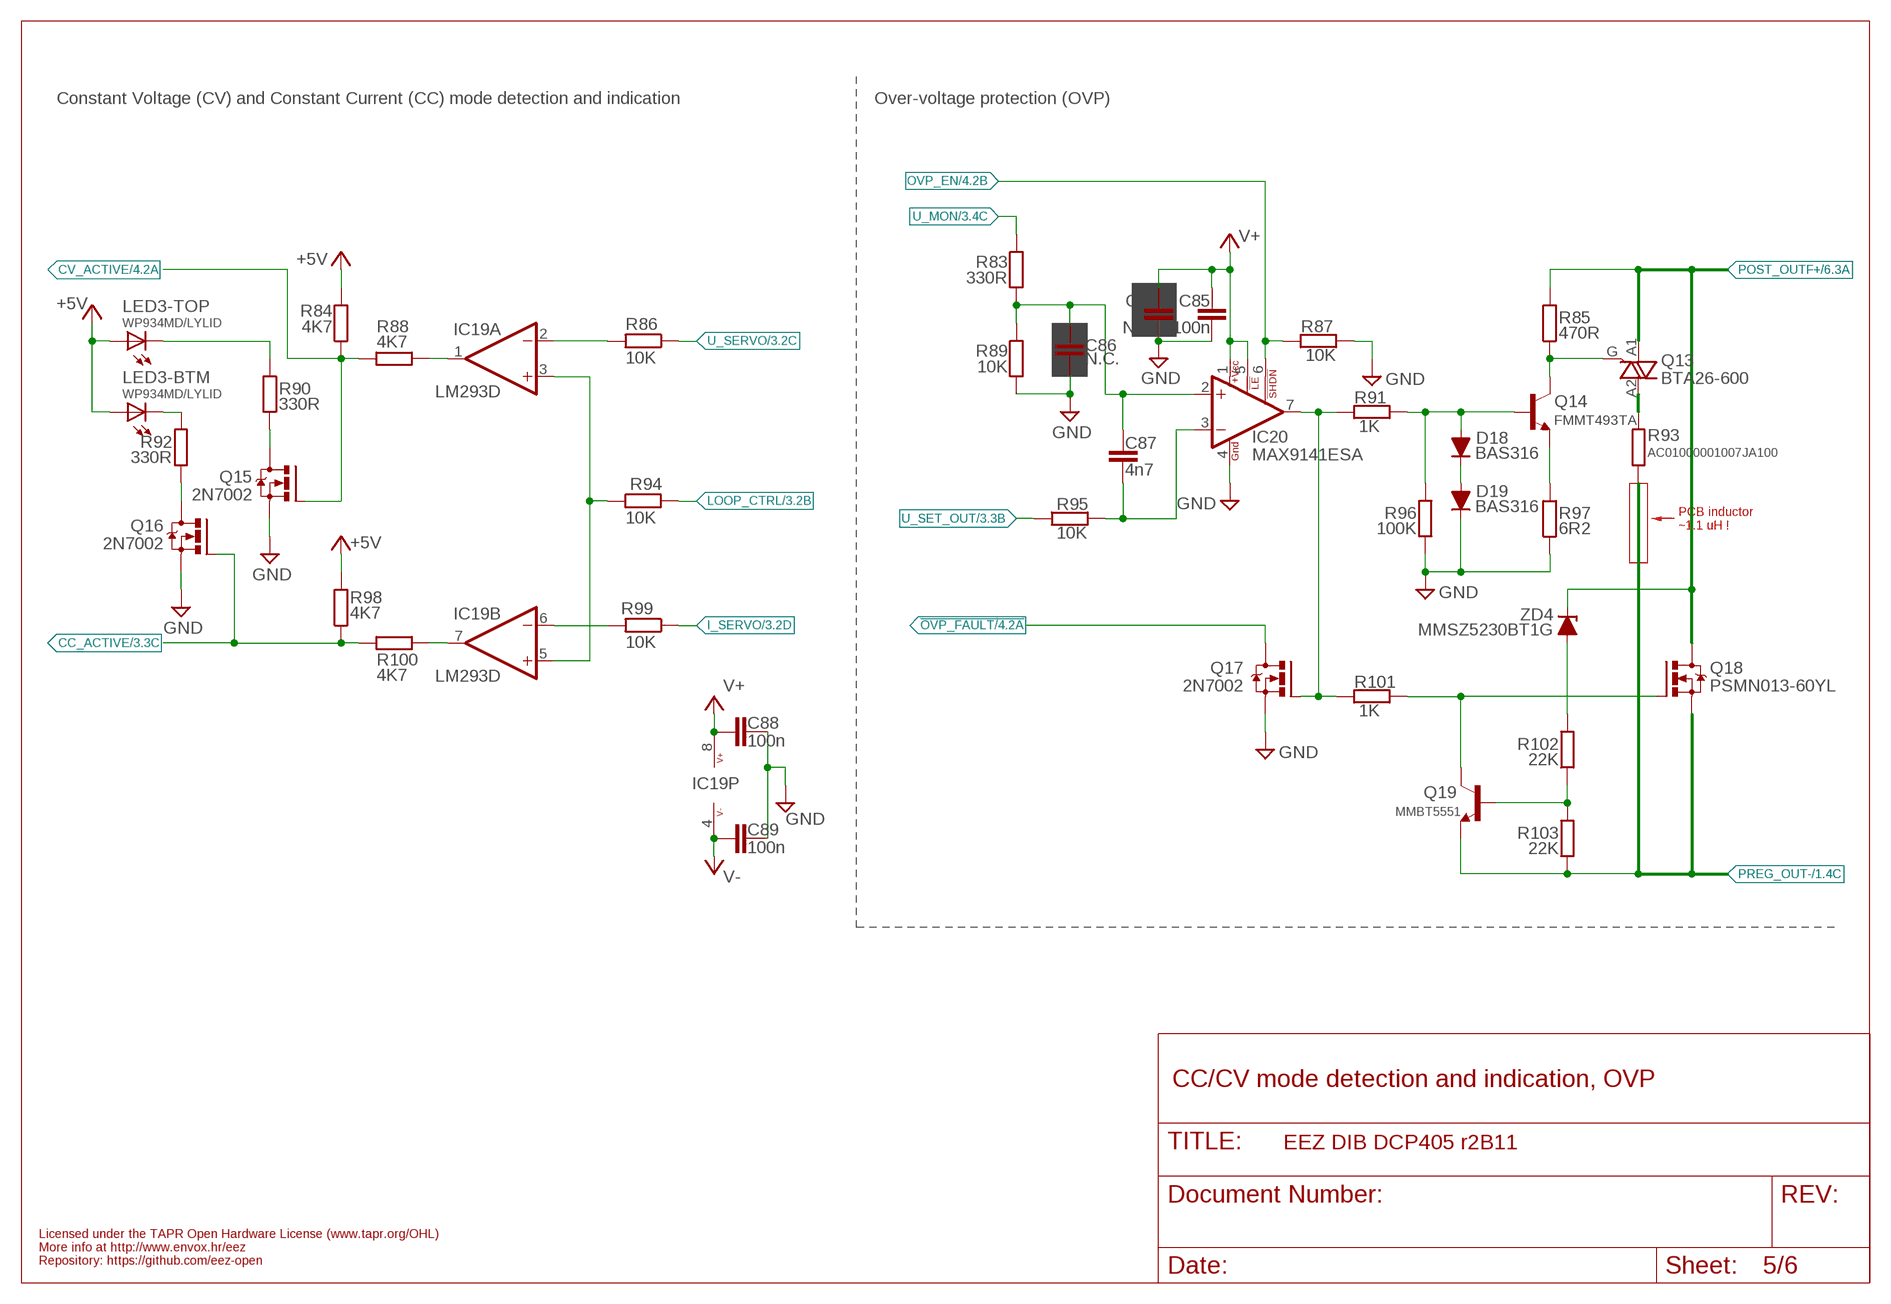
[diagram p4: schematic, sheet 5]

### Parts
C84  N.C.  C-EUC0805  [C0805]
C85  100n  C-EUC0603  [C0603]
C86  N.C.  C-EUC0805  [C0805]
C87  4n7  C-EUC0805  [C0805]
C88  100n  C-EUC0603  [C0603]
C89  100n  C-EUC0603  [C0603]
D18  BAS316  DIODESOD323R  [SOD323-R]
D19  BAS316  DIODESOD323R  [SOD323-R]
IC19  LM293D  [SOIC127P600X173-8N]
IC20  MAX9141ESA  [SOIC127P600X173-8N]
LED3  WP934MD/LYLID  [WP934MD]
Q13  BTA26-600  BTA41-2  [TOP3_TRIAC_NOHOLE]
Q14  FMMT493TA  MMBT5551LT1-NPN-SOT23-BEC  [SOT23-BEC]
Q15  2N7002  [SOT103P240X110-3N]
Q16  2N7002  [SOT103P240X110-3N]
Q17  2N7002  [SOT103P240X110-3N]
Q18  PSMN013-60YL  N-MOSFETLFPAK  [SOT669]
Q19  MMBT5551  MMBT5551LT1-NPN-SOT23-BEC  [SOT23-BEC]
R83  330R  R-EU_R0805  [R0805]
R84  4K7  R-EU_R0805  [R0805]
R85  470R  R-EU_R0805  [R0805]
R86  10K  R-EU_R0805  [R0805]
R87  10K  R-EU_R0805  [R0805]
R88  4K7  R-EU_R0805  [R0805]
R89  10K  R-EU_R0805  [R0805]
R90  330R  R-EU_R0805  [R0805]
R91  1K  R-EU_R0805  [R0805]
R92  330R  R-EU_R0805  [R0805]
R93  AC01000001007JA100  R-EU_0411/15  [0411/15]
R94  10K  R-EU_R0805  [R0805]
R95  10K  R-EU_R0805  [R0805]
R96  100K  R-EU_R0805  [R0805]
R97  6R2  R-EU_R0805  [R0805]
R98  4K7  R-EU_R0805  [R0805]
R99  10K  R-EU_R0805  [R0805]
R100  4K7  R-EU_R0805  [R0805]
R101  1K  R-EU_R0805  [R0805]
R102  22K  R-EU_R0805  [R0805]
R103  22K  R-EU_R0805  [R0805]
ZD4  MMSZ5230BT1G  ZENER-DIODESOD123  [SOD123]

### Nets
!OVP_FAULT: Q17.3(D) ; also sheet 4
+5V: LED3.BA(-BTM:A) LED3.TA(-TOP:A) R84.2 R98.2 ; also sheet 2,4,6
CC_ACTIVE: Q16.1(G) R98.1 R100.2 ; also sheet 3,4
CC_LED: LED3.BC(-BTM:C) R92.2
CV_ACTIVE: Q15.1(G) R84.1 R88.2 ; also sheet 4
CV_LED: LED3.TC(-TOP:C) R90.1
D_CC: Q16.3(D) R92.1
D_CV: Q15.3(D) R90.2
GND: C84.2 C85.1 C86.1 C88.1 C89.1 D19.C IC20.4(GND) Q15.2(S) Q16.2(S) Q17.2(S) R87.1 R89.2 R96.1 R97.1 ; also sheet 1,2,3,4,6
I_SERVO: R99.1 ; also sheet 3
LOOP_CTRL: R94.2 ; also sheet 3
N$13: IC20.7(OUT) Q17.1(G) R91.2 R101.2
N$15: Q13.A2 R93.2
N$18: Q13.G Q14.C R85.1
N$19: Q14.E R97.2
N$20: D18.C D19.A
N$21: D18.A Q14.B R91.1 R96.2
N$24: R102.2 ZD4.A
N$28: Q19.B R102.1 R103.2
N$31: C87.2 IC20.3(-IN) R95.2
N$33: C86.2 C87.1 IC20.2(+IN) R83.2 R89.1
N$44: Q18.4(G) Q19.C R101.1
N$105: IC19.1(A:OUT) R88.1
N$106: IC19.7(B:OUT) R100.1
N$153: IC19.2(A:-IN) R86.2
N$161: IC19.6(B:-IN) R99.2
N$170: IC19.3(A:+IN) IC19.5(B:+IN) R94.1
OVP_EN: IC20.6(!SHDN) R87.2 ; also sheet 4
POST_OUTF+: Q13.A1 Q18.MB(D) R85.2 ZD4.C ; also sheet 6
PREG_OUT-: Q18.1(S) Q18.2(S) Q18.3(S) Q19.E R93.1 R103.1 ; also sheet 1,3
U_MON: R83.1 ; also sheet 3,4
U_SERVO: R86.1 ; also sheet 3
U_SET_OUT: R95.1 ; also sheet 3,4
V+: C84.1 C85.2 C88.2 IC19.8(P:V+) IC20.1(+VCC) IC20.5(!LE) ; also sheet 2,3,4
V-: C89.2 IC19.4(P:V-) ; also sheet 2,3

### Notes on the sheet
- Constant Voltage (CV) and Constant Current (CC) mode detection and indication | Over-voltage protection (OVP)
- PCB inductor
  ~1.1 uH !
- CC/CV mode detection and indication, OVP
- Licensed under the TAPR Open Hardware License (www.tapr.org/OHL)
- More info at http://www.envox.hr/eez
- Repository: https://github.com/eez-open

## Sheet 6 of 6: Rsense protection, power output
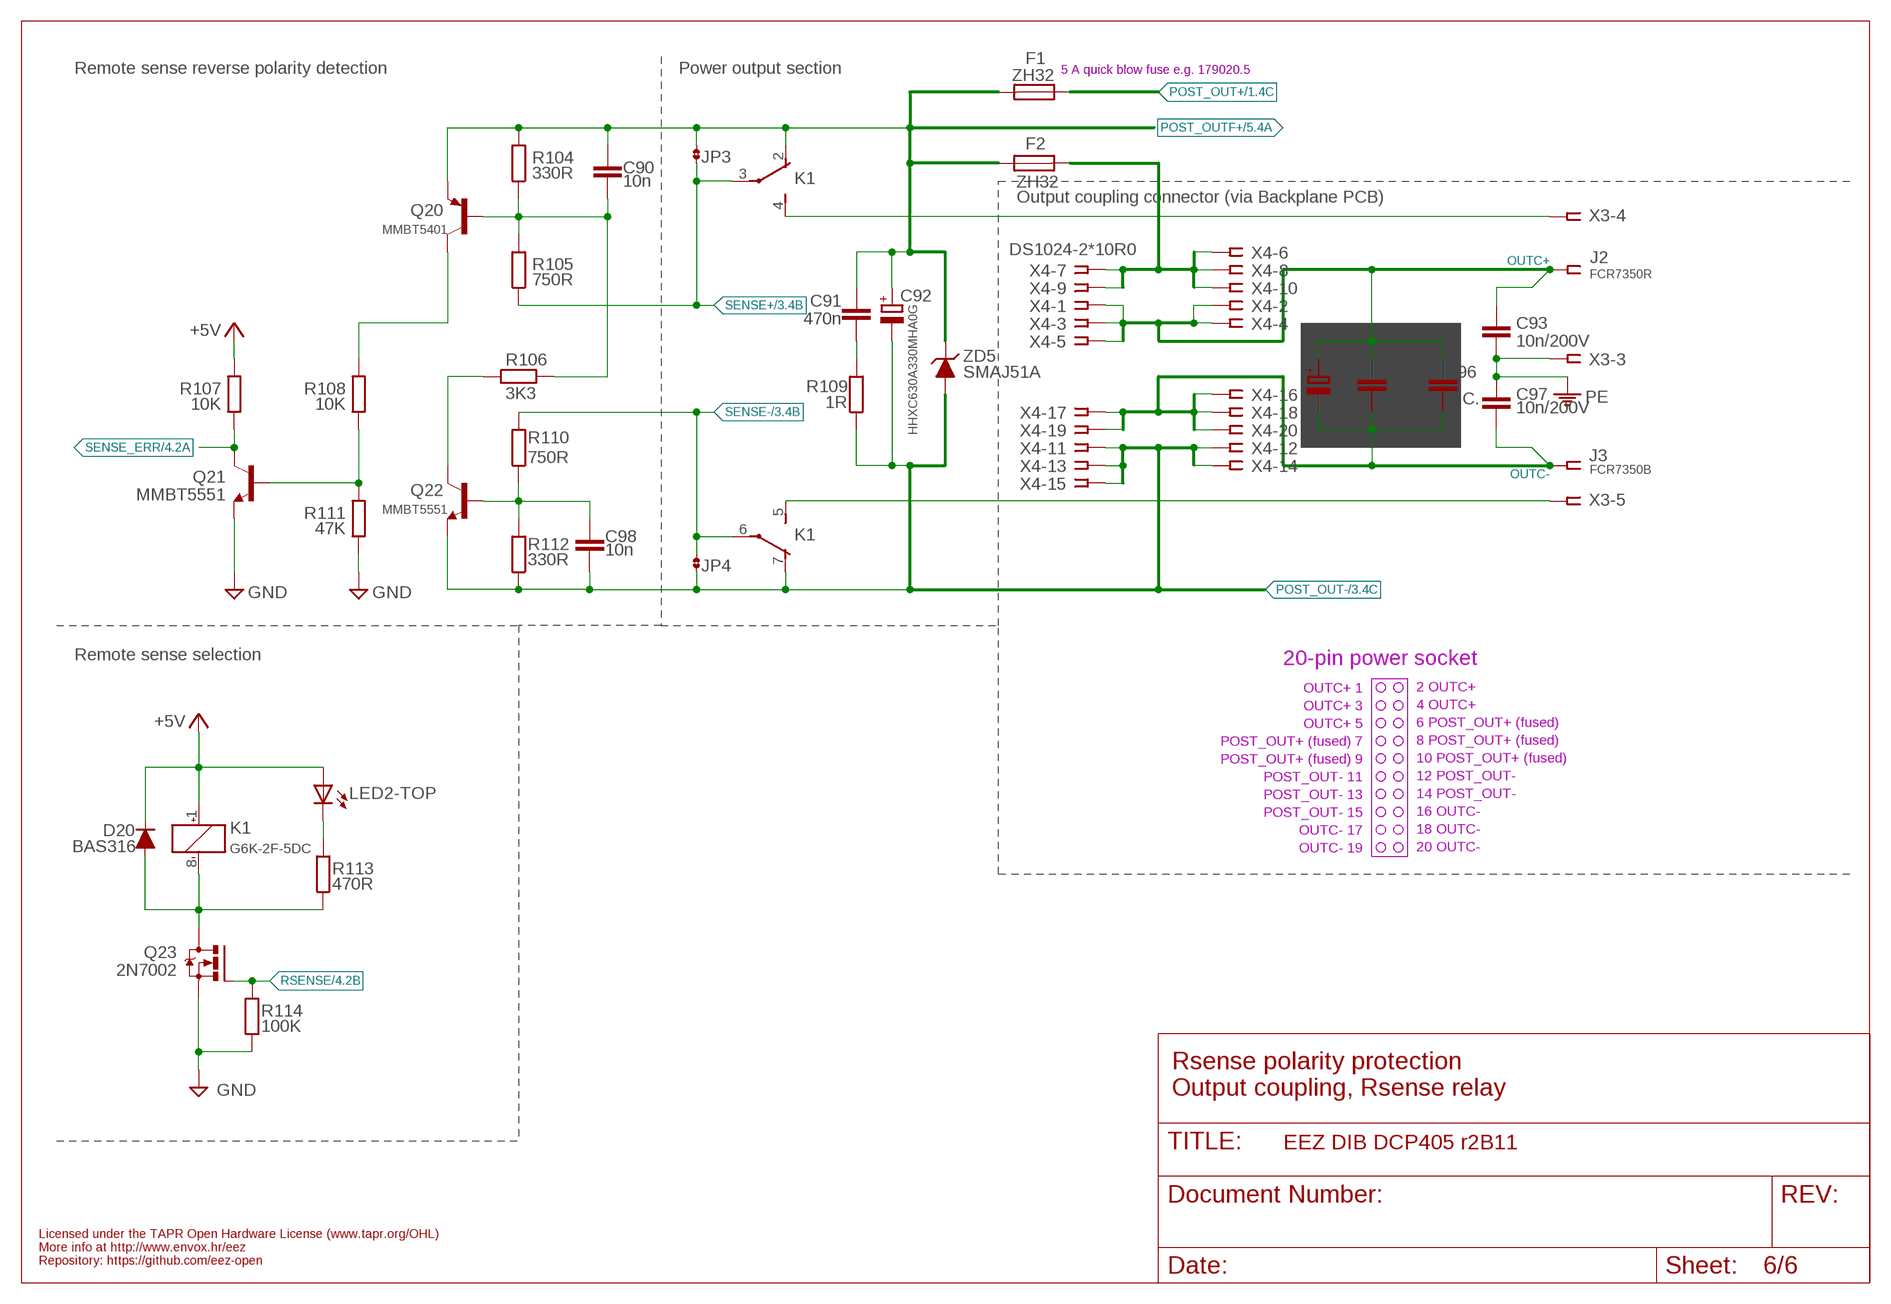
[diagram p5: schematic, sheet 6]

### Parts
C90  10n  C-EUC0805  [C0805]
C91  470n  C-EUC0805  [C0805]
C92  HHXC630A330MHA0G  ECAPSMD8.3MM/HA0  [CAPAE830X1050N]
C93  10n/200V  C-EUC1206  [C1206]
C94  N.C.  ECAP2G/5  [ECAP2/5]
C95  N.C.  C-EUC0805  [C0805]
C96  N.C.  C-EUC0805  [C0805]
C97  10n/200V  C-EUC1206  [C1206]
C98  10n  C-EUC0805  [C0805]
D20  BAS316  DIODESOD323R  [SOD323-R]
F1  ZH32  [ZH32]
F2  ZH32  [ZH32]
J2  FCR7350R  BINDING_POSTCLIFF  [S16N-PC]
J3  FCR7350B  BINDING_POSTCLIFF  [S16N-PC]
JP3  JP2-CUT-0805  [R_0805]
JP4  JP2-CUT-0805  [R_0805]
K1  G6K-2F-5DC  G6K-2F  [G6K-2F]
Q20  MMBT5401  BC857B-PNP-SOT23-BEC  [SOT23-BEC]
Q21  MMBT5551  MMBT5551LT1-NPN-SOT23-BEC  [SOT23-BEC]
Q22  MMBT5551  MMBT5551LT1-NPN-SOT23-BEC  [SOT23-BEC]
Q23  2N7002  [SOT103P240X110-3N]
R104  330R  R-EU_R0805  [R0805]
R105  750R  R-EU_R0805  [R0805]
R106  3K3  R-EU_R0805  [R0805]
R107  10K  R-EU_R0805  [R0805]
R108  10K  R-EU_R0805  [R0805]
R109  1R  R-EU_R1206  [R1206]
R110  750R  R-EU_R0805  [R0805]
R111  47K  R-EU_R0805  [R0805]
R112  330R  R-EU_R0805  [R0805]
R113  470R  R-EU_R0805  [R0805]
R114  100K  R-EU_R0805  [R0805]
X4  DS1024-2*10R0  SSW-110-02-T-D-RA  [SSW-110-02-T-D-RA]
ZD5  SMAJ51A  P6SMB68A  [DO214AA]

### Nets
+5V: D20.C K1.1(1:+) LED2.TA(-TOP:A) R107.2 ; also sheet 2,4,5
GND: Q21.E Q23.2(S) R111.1 R114.1 ; also sheet 1,2,3,4,5
N$107: C90.2 Q20.B R104.1 R105.2 R106.2
N$108: Q20.C R108.2
N$109: Q22.C R106.1
N$110: C98.1 Q22.B R110.1 R112.2
N$112: Q21.B R108.1 R111.2
N$113: C91.2 R109.2
N$114: D20.A K1.8(1:-) Q23.3(D) R113.1
N$115: K1.4(2:S) X3.4
N$116: K1.5(3:S) X3.5
N$120: LED2.TC(-TOP:C) R113.2
OUTC+: C93.1 C94.+ C95.1 C96.1 J2.1 J2.NC1 J2.NC2 J2.NC3 J2.NC4 X4.1 X4.2 X4.3 X4.4 X4.5
OUTC-: C94.- C95.2 C96.2 C97.2 J3.1 J3.NC1 J3.NC2 J3.NC3 J3.NC4 X4.16 X4.17 X4.18 X4.19 X4.20
OUTF+: F2.2 X4.6 X4.7 X4.8 X4.9 X4.10
PE: C93.2 C97.1 X3.3 ; also sheet 1
POST_OUT+: F1.1 ; also sheet 1,3
POST_OUT-: C92.- C98.2 JP4.1 K1.7(3:O) Q22.E R109.1 R112.1 X4.11 X4.12 X4.13 X4.14 X4.15 ZD5.A ; also sheet 3
POST_OUTF+: C90.1 C91.1 C92.+ F1.2 F2.1 JP3.2 K1.2(2:O) Q20.E R104.2 ZD5.C ; also sheet 5
RSENSE: Q23.1(G) R114.2 ; also sheet 4
SENSE+: JP3.1 K1.3(2:P) R105.1 ; also sheet 3
SENSE-: JP4.2 K1.6(3:P) R110.2 ; also sheet 3
SENSE_ERR: Q21.C R107.1 ; also sheet 4

### Notes on the sheet
- Remote sense reverse polarity detection | Power output section | 5 A quick blow fuse e.g. 179020.5
- Output coupling connector (via Backplane PCB)
- Remote sense selection | 20-pin power socket
- OUTC+ 1
- 2 OUTC+
- OUTC+ 3
- 4 OUTC+
- OUTC+ 5
- 6 POST_OUT+ (fused)
- POST_OUT+ (fused) 7
- 8 POST_OUT+ (fused)
- POST_OUT+ (fused) 9
- 10 POST_OUT+ (fused)
- POST_OUT- 11
- 12 POST_OUT-
- POST_OUT- 13
- 14 POST_OUT-
- POST_OUT- 15
- 16 OUTC-
- OUTC- 17
- 18 OUTC-
- OUTC- 19
- 20 OUTC-
- Rsense polarity protection
  Output coupling, Rsense relay
- Licensed under the TAPR Open Hardware License (www.tapr.org/OHL)
- More info at http://www.envox.hr/eez
- Repository: https://github.com/eez-open

## Library data of the parts
C1 C3-C10 C12 C14 C15 C17-C68 C70-C91 C93 C95-C98 = rcl:C-EU: CAPACITOR, European symbol
C2 C11 C13 C16 C69 C92 C94 = EEZ_Lib1:ECAP
D1 D3 D10-D13 D15 D16 D18-D20 = EEZ_Lib1:DIODE
D2 D4-D9 D14 D17 = EEZ_Lib1:SCHOTTKY
F1 F2 = EEZ_Lib1:ZH32: Fuse holder with cover; tube fuses; 5x20mm
FB1-FB3 = EEZ_Lib1:FERRITE_BEAD: FAIR-RITE - 2506033007Y3 - FERRITE BEAD, 0.04OHM, 3A, 0603 Farnell: 2112873
FM1-FM3 = EEZ_Lib1:FIDUCIAL: Fiducial mark for pick and place automation
GND = EEZ_Lib1:PCB_TEST_TAB
I_SET JP1 OE U_SET = EEZ_Lib1:JP2-NOCUT
IC1 = EEZ_Lib1:LTC3864: 60V Low Iq Step-Down DC/DC Controller with 100% Duty Cycle Capability
IC2 = EEZ_Lib1:TPS54060: 0.5A, 60V Step Down SWIFT DC/DC Converter with ECO-MODE,MSOP-10; MPN: TPS54060ADGQ; OC_FARNELL: 2099922; OC_NEWARK: 05W5854; PACKAGE: MSOP-10; SUPPLIER: TEXAS INSTRUMENTS
IC3 IC7 = EEZ_Lib1:SI8641: Low power 4-ch digital isolator (3+1) Farnell: 2423288
IC4 = EEZ_DIB:SN74LVC1G139: 2-to-4 Line Decoder
IC5 = EEZ_Lib1:MC78LXX: μA78L00 series positive voltage regulators
IC6 = EEZ_Lib1:MC79LXX: 3-terminal negative voltage regulator, up to 100mA
IC8 = EEZ_Lib1:AT24CXX: I2C-Compatible (2-wire) Serial EEPROM
IC9 IC10 = EEZ_Lib1:TL072
IC11 = EEZ_Lib1:OP27GSZ: Low Noise, Precision Operational Amplifier
IC12 = EEZ_Lib1:SN74LVC1G74DCTR: Single Positive-Edge-Triggered D-Type Flip-Flop with Clear and Preset
IC13 = EEZ_Lib1:MCP23S17-E/SS: 16-Bit I/O Expander with Serial Interface; FARNELL: 1467675; TME: MCP23S17-E/SS
IC14 = EEZ_Lib1:REF50XX: Low-Noise (3μVpp/V), Very Low Drift (max. 8ppm/°C), Precision Voltage Reference Pin compatible with REF2 Farnell: 1439628
IC15 = EEZ_Lib1:TC77: Thermal Sensor with SPI Interface
IC16 = EEZ_Lib1:DAC8552_DGK_8
IC17 IC21 = EEZ_Lib1:SN74LVC1G3157
IC18 = EEZ_Lib1:ADS1120: Low-Power, Low-Noise, 16-Bit, Analog-to-Digital Converter for Small-Signal Sensors Farnell: 2402249
IC19 = EEZ_Lib1:LM293: Dual Differential Comparators
IC20 = EEZ_Lib1:MAX9141: 40ns, Low-Power, 3V/5V, Rail-to-Rail Single-Supply Comparator
J1 = EEZ_connectors:PCB_TAB: PCB quick-fit terminal
J2 J3 = EEZ_connectors:BINDING_POST: Various 4 mm binding posts
JP2-JP4 = EEZ_Lib1:JP2-CUT
K1 = relay:G6K: Low Signal Relay oeiwcsnts1.omron.com/.. D20G6K0100.pdf; MF: OMRON COMPONENTS USA; MPN: G6K-2F DC24; OC_FARNELL: 1690427; OC_NEWARK: 36K7467
KK1 KK2 = EEZ_Lib1:PCB-MB: Richo Mounting Block; 16 x 6 mm
KK3 = EEZ_Lib1:SK96/84
L1 = EEZ_Lib1:RN112
L2 = EEZ_inductors_and_transformers:125CDMCC/DS: Sumida SMD power inductor 13.8×12.9×5.0mm
L3 = EEZ_inductors_and_transformers:COILCRAFT_HPI0630: High power inductor
LED1 = EEZ_Lib1:LED_L-42WUM/1EGWT: 3 mm right angle bicolor LED indicator
LED2 LED3 = EEZ_Lib1:WP934MD: Kingbright LED; in housing; 3mm; No.of diodes:2
OSHWA = EEZ_Lib1:OSHWA-CERT
Q1 Q5 = EEZ_Lib1:P-MOSFET: HEXFET Power MosFet Source: http://www.irf.com/
Q2 Q7 Q20 = transistor:*-PNP-: PNP Transistror
Q3 Q4 = EEZ_Lib1:D45H11
Q6 = EEZ_Lib1:BCP56: Low power NPN Transistor, Vceo=80V, Ic=1A, SOT-223
Q8 = EEZ_Lib1:NZT605: NPN Darlington Transistor
Q9 Q15-Q17 Q23 Q27 = EEZ_Lib1:2N7002: N-CHANNEL ENHANCEMENT MODE FIELD EFFECT TRANSISTOR; MPN: 2N7002-7-F; OC_FARNELL: 1713823; OC_NEWARK: 25R5679; PACKAGE: SOT-23-3; SUPPLIER: DIODES INC.
Q10 Q11 Q18 = EEZ_Lib1:N-MOSFET
Q12 = EEZ_Lib1:IRLML2246TRPBF: HEXFET Power MOSFET (-20V, -2.6A); MPN: IRLML2246TRPBF; OC_FARNELL: 1888166; OC_NEWARK: 40T7450; PACKAGE: SOT-3; SUPPLIER: International Rectifier; TME: IRLML2246TRPBF
Q13 = EEZ_Lib1:BTA41: Triac; 40A; 50mA; THT; TOP3
Q14 Q19 Q21 Q22 = transistor:*-NPN-: NPN Transistror BF959 corrected 2008.03.06
R1-R66 R68-R116 R118 = rcl:R-EU_: RESISTOR, European symbol
R67 = EEZ_Lib1:R-EU_4WIRE
RN1 RN2 = EEZ_Lib1:R_ARRAY4: 1206 four resistor array
SH1-SH3 = EEZ_Lib1:SHORT
TR1 = EEZ_inductors_and_transformers:BOURNS_SRF0703INV: Bourns SRF0703 Series - Dual-Winding Shielded Power Inductors
X1 = EEZ_connectors:MINIFIT_39301020: Molex Socket; wire-board; male; Mini-Fit Jr; 4.2mm; PIN:2; THT; PCB snap
X2 = EEZ_connectors:77317-104-28LF: Headers & Wire Housings 28P right angle 0.1" pitch
X3 = EEZ_connectors:MC1,5/5-G-3,5: Pluggable Terminal Blocks, angled, 5-pin 3.5mm pitch Through Hole Header
X4 = EEZ_connectors:SSW-110-02-T-D-RA: Samtec SSW-113-02-T-D-RA Receptacle, 2.54MM, RA, 20-way
ZD1 ZD5 = EEZ_Lib1:P6SMB68A: Transient Voltage Suppression Diodes, DO-214AA
ZD2 ZD4 = EEZ_Lib1:ZENER-DIODE
ZD3 = EEZ_Lib1:SLVU2.8: 2.8Volts ESD Protection Devices

## Net classes
0 default: width 0.203 mm, drill 0.3 mm, clearance 0.203 mm
1 lvds: width 0.152 mm, drill 0.3 mm, clearance 0.152 mm to class 0, clearance 0.152 mm
2 gnd: width 0.254 mm, drill 0.584 mm, clearance 0.254 mm